# Altium schematic sheet 04_SRAD_Ejection_Charges.SchDoc.SchDoc
size A4; DrawnBy: Juan Rafael Munoz, Jr.; DocumentNumber: 4; SheetNumber: 4; SheetTotal: 4
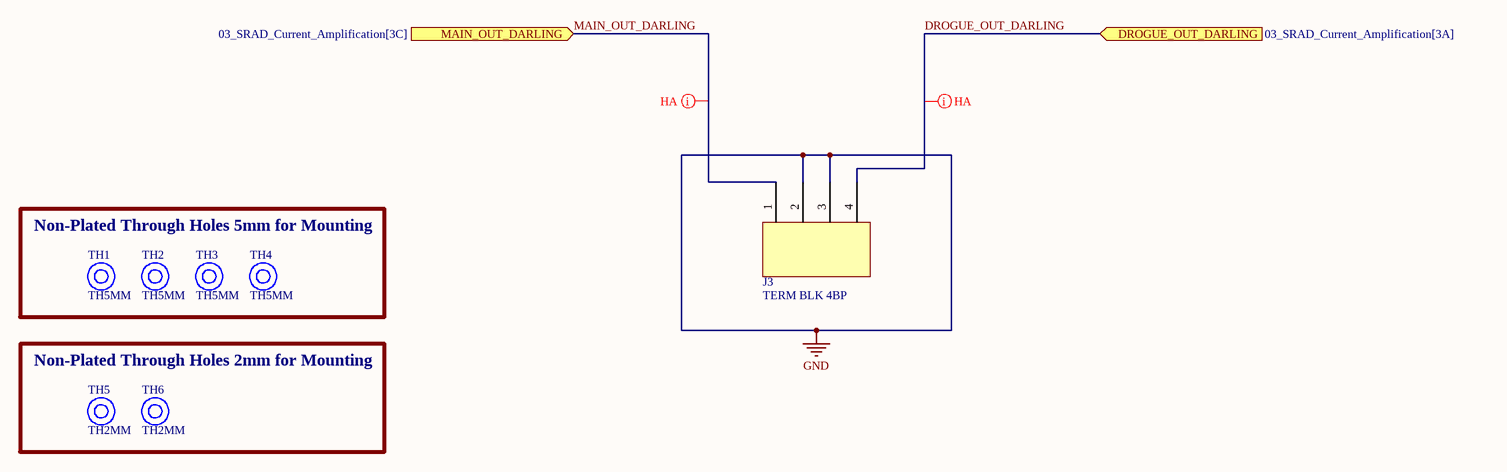
[diagram p0: 04_SRAD_Ejection_Charges.SchDoc.SchDoc]

## Parts
J3  TERM BLK 4BP  [PCB TERM BLK 4P 2.54MM]
TH1  TH5MM  [Mounting Hole Non-Plated]  (no BOM)
TH2  TH5MM  [Mounting Hole Non-Plated]  (no BOM)
TH3  TH5MM  [Mounting Hole Non-Plated]  (no BOM)
TH4  TH5MM  [Mounting Hole Non-Plated]  (no BOM)
TH5  TH2MM  [Mounting Hole Non-Plated 2MM]  (no BOM)
TH6  TH2MM  [Mounting Hole Non-Plated 2MM]  (no BOM)

## Blocks framed on the sheet
Non-Plated Through Holes 5mm for Mounting: TH1-TH4
Non-Plated Through Holes 2mm for Mounting: TH5 TH6

## Ports
DROGUE_OUT_DARLING (in, see 03_SRAD_Current_Amplification[3A]), MAIN_OUT_DARLING (in, see 03_SRAD_Current_Amplification[3C])

## Nets
GND: J3.2 J3.3
DROGUE_OUT_DARLING: J3.4 ; port DROGUE_OUT_DARLING
MAIN_OUT_DARLING: J3.1 ; port MAIN_OUT_DARLING

## Layout directives
rule Width Constraint [Pref Width = 1mm    Min Width = 0.3mm    Max Width = 1mm]: DROGUE_OUT_DARLING, MAIN_OUT_DARLING

## Notes on the sheet
- Title:
- Company:
- Date:
- Sheet
- of
- Drawn By:

## Library data of the parts
J3 = PCB TERM BLK 4P 2.54MM: 4 Position Wire to Board Terminal Block Horizontal with Board 0.100" (2.54mm) Through Hole 10A 150V 16-30 AWG 0.2 Nm M1.6 screw -40°C ~ 105°C; Manufacturer: TE Connectivity; Manufacturer Part Number: 282834-4; Plating: Brass,Steel; Number of Poles: 4; Number of Levels: 1; Connector Type: Receptacle; Closed End: No (Without); Screwless Terminal Block: Yes (With); Wire/Cable Gauge: 30AWG; Tail Length: 3.4mm; Approvals: UL; Supplier 1: Digi-Key; RoHS: Yes; Category: Terminal Blocks; Stock 1: 8416; Pricing 1: 1=3.48000, 10=2.64900, 25=2.48120, 50=2.20540, 100=2.15740, 250=1.98964, 500=1.79786, 1000=1.59409, 5000=1.49821 (USD); Mounting Technology: Through Hole; Contact Plating: Tin; Contact Material: Brass; Color: Green; Housing Color: Green; Housing Material: Polyamide; Min Operating Temperature: -40°C; Max Operating Temperature: 105°C; Voltage Rating: 150V; Package Quantity: 150; Packaging: Bulk; Max Voltage Rating (AC): 150V; Number of Rows: 1; Current Rating: 10A; Number of Positions Per Level: 4; Current: 10A; Voltage: 150V; Termination: Solder; Number of Positions: 4; Number of Contacts: 4; Number of Circuits: 4; Max Supply Voltage (AC): 150V; Orientation: Straight; Max Current Rating: 10A; Interlock: No (Without); Screw Flange: No (Without); Side Stackable: Yes (With); Series: Buchanan; Length: 10.62mm; Wire Gauge (Max): 30AWG; Wire Gauge (Min): 30AWG; Pitch: 2.54mm; Thread Size: M1.6; Depth: 6.5mm; Radiation Hardening: No; ELV: Compliant; Lead Free: Lead Free; Flammability Rating: UL94 V-0; RoHS Compliant: Yes; ComponentLink1URL: https://datasheet.ciiva.com/5741/1605505-5741440.pdf?src-supplier=Farnell; ComponentLink1Description: https://datasheet.ciiva.com/5741/1605505-5741440.pdf?src-supplier=Farnell; ComponentLink2URL: https://datasheet.ciiva.com/30254/eng-cs-1308389-eurostyle-terminal-blocks-0607-30254374.pdf?src-supplier=Onlinecomponents.com; ComponentLink2Description: https://datasheet.ciiva.com/30254/eng-cs-1308389-eurostyle-terminal-blocks-0607-30254374.pdf?src-supplier=Onlinecomponents.com; ComponentLink3URL: https://datasheet.ciiva.com/14609/70087596-14609846.pdf?src-supplier=Allied+Electronics; ComponentLink3Description: https://datasheet.ciiva.com/14609/70087596-14609846.pdf?src-supplier=Allied+Electronics; ComponentLink4URL: https://datasheet.ciiva.com/3141/eng-cs-1308389-eurostyle-terminal-blocks-0607-3141117.pdf?src-supplier=Avnet; ComponentLink4Description: https://datasheet.ciiva.com/3141/eng-cs-1308389-eurostyle-terminal-blocks-0607-3141117.pdf?src-supplier=Avnet; ComponentLink5URL: https://datasheet.ciiva.com/823/eng-cd-282834-c1-823474.pdf?src-supplier=Digi-Key; ComponentLink5Description: https://datasheet.ciiva.com/823/eng-cd-282834-c1-823474.pdf?src-supplier=Digi-Key; Supplier Part Number 1: A98335-ND
TH1-TH4 = Mounting Hole Non-Plated: Non-plated THT 5mm diameter
TH5 TH6 = Mounting Hole Non-Plated 2mm: Non-plated THT 2mm diameter